# EAGLE design MicroDose (EAGLE 9.6.2)
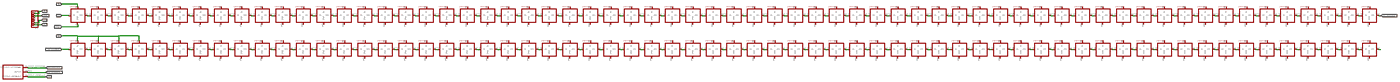
[diagram p0: schematic, sheet 1, overview]
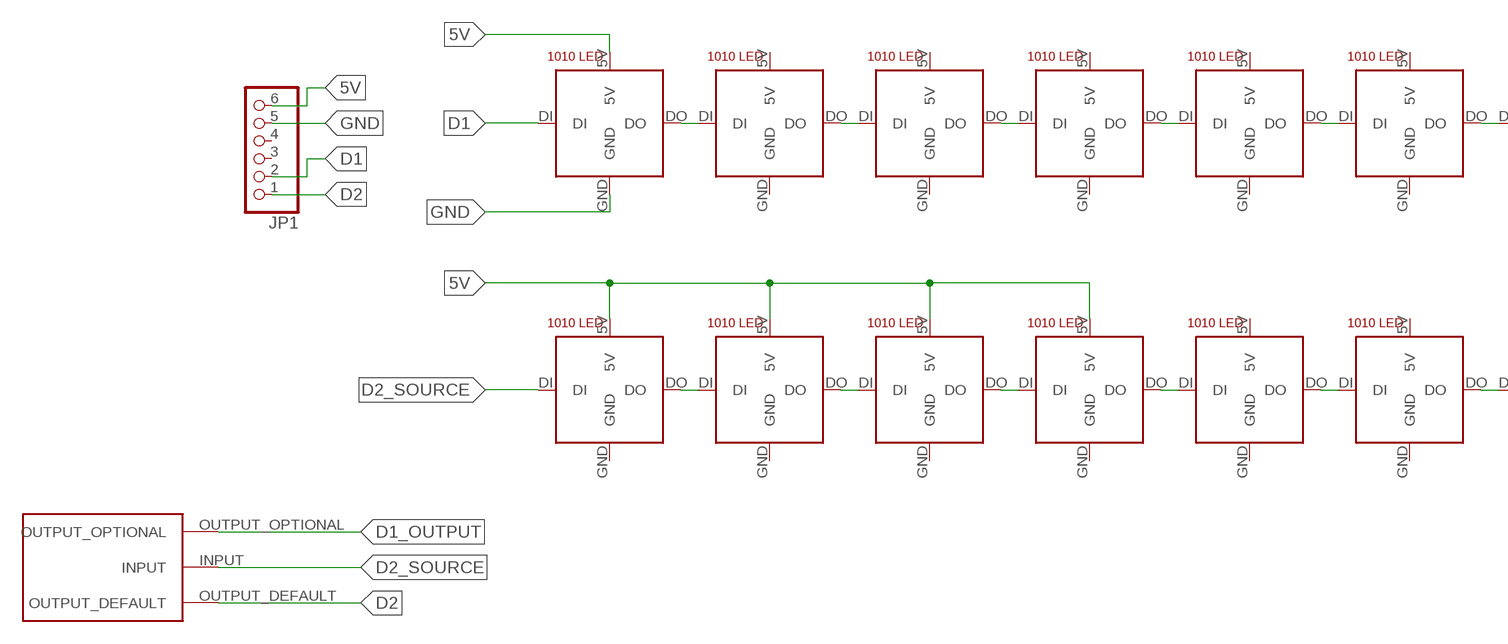
[diagram p1: schematic, sheet 1, part 1 of 5]
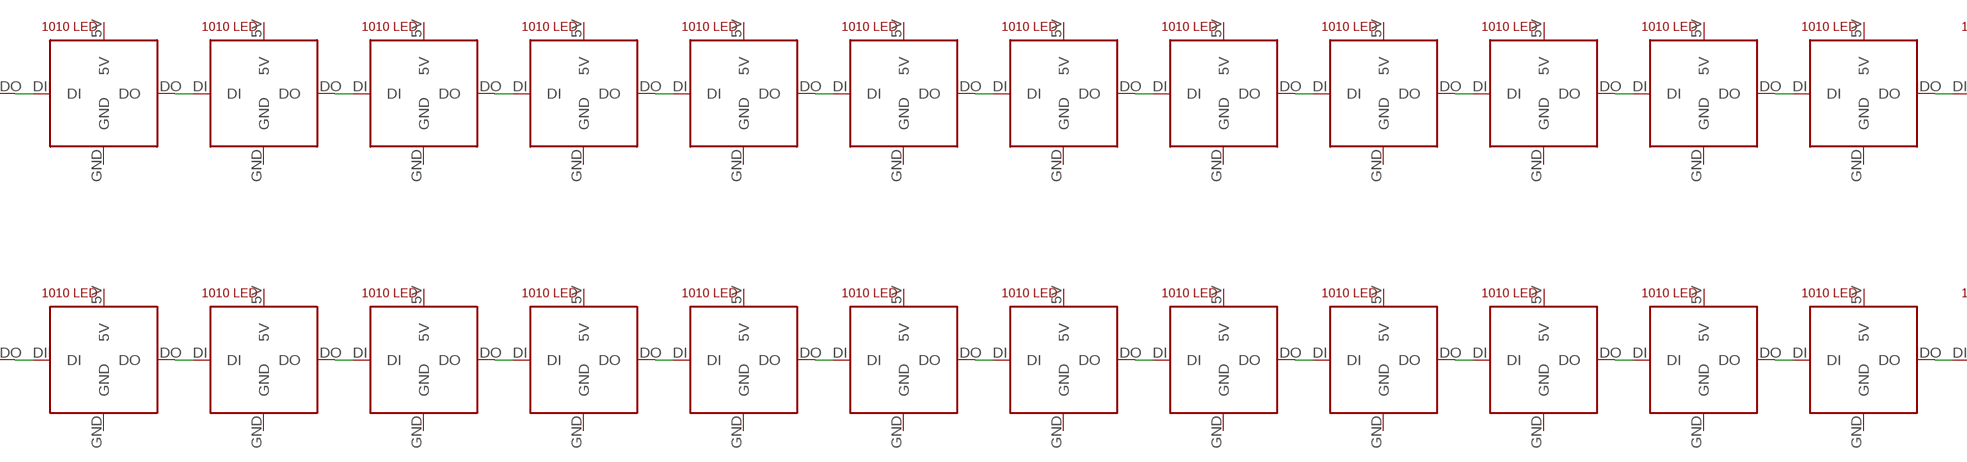
[diagram p2: schematic, sheet 1, part 2 of 5]
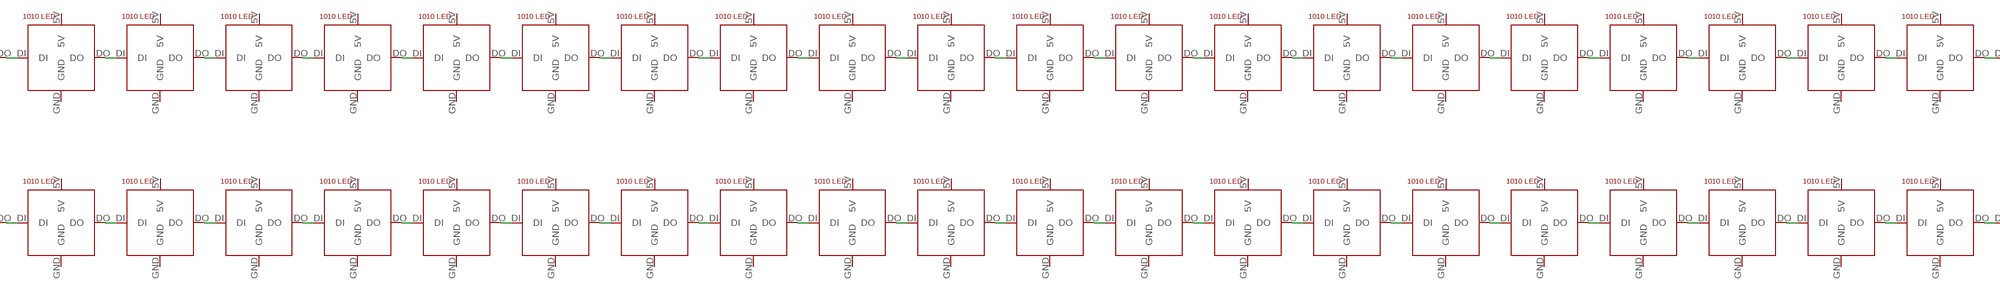
[diagram p3: schematic, sheet 1, part 3 of 5]
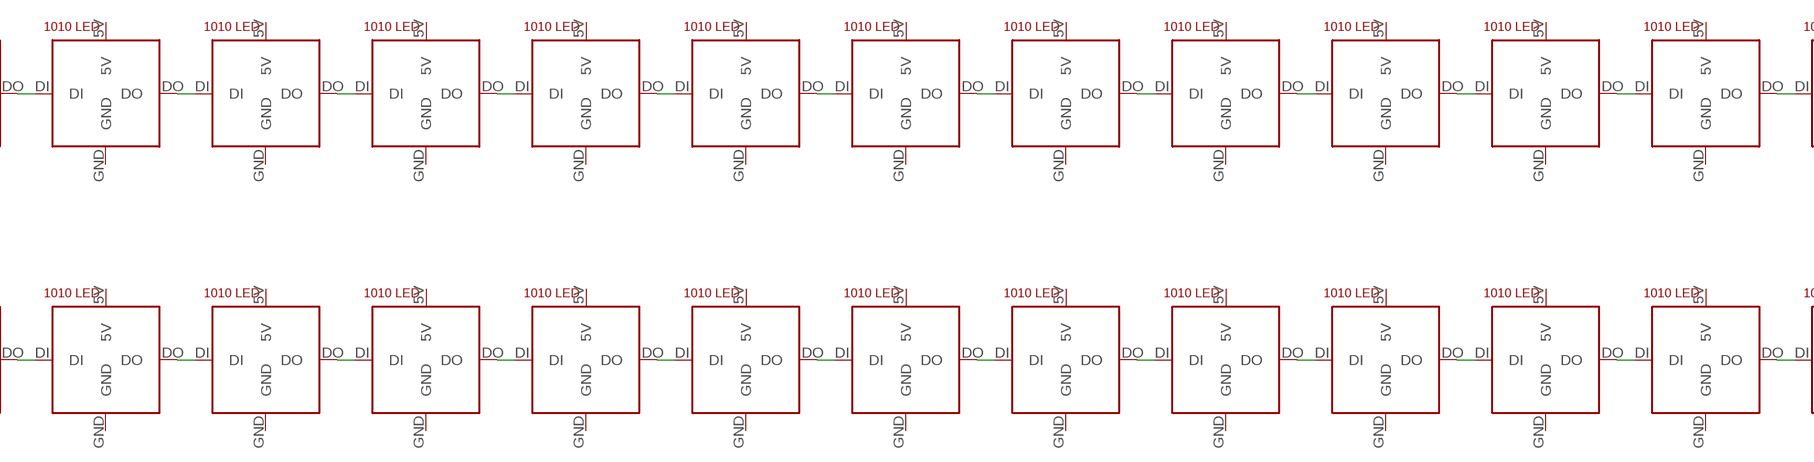
[diagram p4: schematic, sheet 1, part 4 of 5]
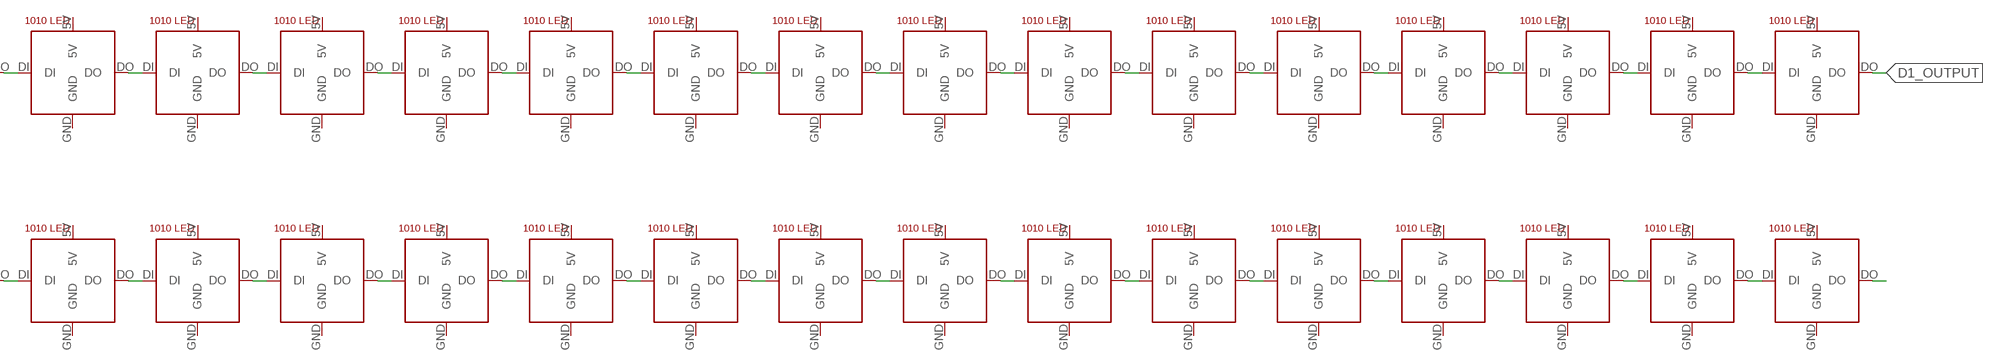
[diagram p5: schematic, sheet 1, part 5 of 5]

## Parts
JP1  PINHD-1X6/90  [1X06/90]
U$1  1010_LED  [1010_LED]
U$2  1010_LED  [1010_LED]
U$3  1010_LED  [1010_LED]
U$4  1010_LED  [1010_LED]
U$5  1010_LED  [1010_LED]
U$6  1010_LED  [1010_LED]
U$7  1010_LED  [1010_LED]
U$8  1010_LED  [1010_LED]
U$9  1010_LED  [1010_LED]
U$10  1010_LED  [1010_LED]
U$11  1010_LED  [1010_LED]
U$12  1010_LED  [1010_LED]
U$13  1010_LED  [1010_LED]
U$14  1010_LED  [1010_LED]
U$15  1010_LED  [1010_LED]
U$16  1010_LED  [1010_LED]
U$17  1010_LED  [1010_LED]
U$18  1010_LED  [1010_LED]
U$19  1010_LED  [1010_LED]
U$20  1010_LED  [1010_LED]
U$21  1010_LED  [1010_LED]
U$22  1010_LED  [1010_LED]
U$23  1010_LED  [1010_LED]
U$24  1010_LED  [1010_LED]
U$25  1010_LED  [1010_LED]
U$26  1010_LED  [1010_LED]
U$27  1010_LED  [1010_LED]
U$28  1010_LED  [1010_LED]
U$29  1010_LED  [1010_LED]
U$30  1010_LED  [1010_LED]
U$31  1010_LED  [1010_LED]
U$32  1010_LED  [1010_LED]
U$33  1010_LED  [1010_LED]
U$34  1010_LED  [1010_LED]
U$35  1010_LED  [1010_LED]
U$36  1010_LED  [1010_LED]
U$37  1010_LED  [1010_LED]
U$38  1010_LED  [1010_LED]
U$39  1010_LED  [1010_LED]
U$40  1010_LED  [1010_LED]
U$41  1010_LED  [1010_LED]
U$42  1010_LED  [1010_LED]
U$43  1010_LED  [1010_LED]
U$44  1010_LED  [1010_LED]
U$45  1010_LED  [1010_LED]
U$46  1010_LED  [1010_LED]
U$47  1010_LED  [1010_LED]
U$48  1010_LED  [1010_LED]
U$49  1010_LED  [1010_LED]
U$50  1010_LED  [1010_LED]
U$51  1010_LED  [1010_LED]
U$52  1010_LED  [1010_LED]
U$53  1010_LED  [1010_LED]
U$54  1010_LED  [1010_LED]
U$55  1010_LED  [1010_LED]
U$56  1010_LED  [1010_LED]
U$57  1010_LED  [1010_LED]
U$58  1010_LED  [1010_LED]
U$59  1010_LED  [1010_LED]
U$60  1010_LED  [1010_LED]
U$61  1010_LED  [1010_LED]
U$62  1010_LED  [1010_LED]
U$63  1010_LED  [1010_LED]
U$64  1010_LED  [1010_LED]
U$65  1010_LED  [1010_LED]
U$66  1010_LED  [1010_LED]
U$67  1010_LED  [1010_LED]
U$68  1010_LED  [1010_LED]
U$69  1010_LED  [1010_LED]
U$70  1010_LED  [1010_LED]
U$71  1010_LED  [1010_LED]
U$72  1010_LED  [1010_LED]
U$73  1010_LED  [1010_LED]
U$74  1010_LED  [1010_LED]
U$75  1010_LED  [1010_LED]
U$76  1010_LED  [1010_LED]
U$77  1010_LED  [1010_LED]
U$78  1010_LED  [1010_LED]
U$79  1010_LED  [1010_LED]
U$80  1010_LED  [1010_LED]
U$81  1010_LED  [1010_LED]
U$82  1010_LED  [1010_LED]
U$83  1010_LED  [1010_LED]
U$84  1010_LED  [1010_LED]
U$85  1010_LED  [1010_LED]
U$86  1010_LED  [1010_LED]
U$87  1010_LED  [1010_LED]
U$88  1010_LED  [1010_LED]
U$89  1010_LED  [1010_LED]
U$90  1010_LED  [1010_LED]
U$91  1010_LED  [1010_LED]
U$92  1010_LED  [1010_LED]
U$93  1010_LED  [1010_LED]
U$94  1010_LED  [1010_LED]
U$95  1010_LED  [1010_LED]
U$96  1010_LED  [1010_LED]
U$97  1010_LED  [1010_LED]
U$98  1010_LED  [1010_LED]
U$99  1010_LED  [1010_LED]
U$100  1010_LED  [1010_LED]
U$101  1010_LED  [1010_LED]
U$102  1010_LED  [1010_LED]
U$103  1010_LED  [1010_LED]
U$104  1010_LED  [1010_LED]
U$105  1010_LED  [1010_LED]
U$106  1010_LED  [1010_LED]
U$107  1010_LED  [1010_LED]
U$108  1010_LED  [1010_LED]
U$109  1010_LED  [1010_LED]
U$110  1010_LED  [1010_LED]
U$111  1010_LED  [1010_LED]
U$112  1010_LED  [1010_LED]
U$113  1010_LED  [1010_LED]
U$114  1010_LED  [1010_LED]
U$115  1010_LED  [1010_LED]
U$116  1010_LED  [1010_LED]
U$117  1010_LED  [1010_LED]
U$118  1010_LED  [1010_LED]
U$119  1010_LED  [1010_LED]
U$120  1010_LED  [1010_LED]
U$121  1010_LED  [1010_LED]
U$122  1010_LED  [1010_LED]
U$123  1010_LED  [1010_LED]
U$124  1010_LED  [1010_LED]
U$125  1010_LED  [1010_LED]
U$126  1010_LED  [1010_LED]
U$127  1010_LED  [1010_LED]
U$128  1010_LED  [1010_LED]
U$129  SOLDER_JUMPER  [SOLDER_JUMPER]

## Nets
5V: JP1.6 U$1.5V U$65.5V U$66.5V U$67.5V U$68.5V
D1: JP1.2 U$1.DI
D1_OUTPUT: U$64.DO U$129.OUTPUT_OPTIONAL
D2: JP1.1 U$129.OUTPUT_DEFAULT
D2_SOURCE: U$65.DI U$129.INPUT
GND: JP1.5 U$1.GND
N$1: U$1.DO U$2.DI
N$2: U$2.DO U$3.DI
N$3: U$3.DO U$4.DI
N$4: U$4.DO U$5.DI
N$5: U$5.DO U$6.DI
N$6: U$6.DO U$7.DI
N$7: U$7.DO U$8.DI
N$8: U$8.DO U$9.DI
N$9: U$9.DO U$10.DI
N$10: U$10.DO U$11.DI
N$11: U$11.DO U$12.DI
N$12: U$12.DO U$13.DI
N$13: U$13.DO U$14.DI
N$14: U$14.DO U$15.DI
N$15: U$15.DO U$16.DI
N$16: U$16.DO U$17.DI
N$17: U$17.DO U$18.DI
N$18: U$18.DO U$19.DI
N$19: U$19.DO U$20.DI
N$20: U$20.DO U$21.DI
N$21: U$21.DO U$22.DI
N$22: U$22.DO U$23.DI
N$23: U$23.DO U$24.DI
N$24: U$24.DO U$25.DI
N$25: U$25.DO U$26.DI
N$26: U$26.DO U$27.DI
N$27: U$27.DO U$28.DI
N$28: U$28.DO U$29.DI
N$29: U$29.DO U$30.DI
N$30: U$30.DO U$31.DI
N$31: U$31.DO U$32.DI
N$32: U$32.DO U$33.DI
N$33: U$33.DO U$34.DI
N$34: U$34.DO U$35.DI
N$35: U$35.DO U$36.DI
N$36: U$36.DO U$37.DI
N$37: U$37.DO U$38.DI
N$38: U$38.DO U$39.DI
N$39: U$39.DO U$40.DI
N$40: U$40.DO U$41.DI
N$41: U$41.DO U$42.DI
N$42: U$42.DO U$43.DI
N$43: U$43.DO U$44.DI
N$44: U$44.DO U$45.DI
N$45: U$45.DO U$46.DI
N$46: U$46.DO U$47.DI
N$47: U$47.DO U$48.DI
N$48: U$48.DO U$49.DI
N$49: U$49.DO U$50.DI
N$50: U$50.DO U$51.DI
N$51: U$51.DO U$52.DI
N$52: U$52.DO U$53.DI
N$53: U$53.DO U$54.DI
N$54: U$54.DO U$55.DI
N$55: U$55.DO U$56.DI
N$56: U$56.DO U$57.DI
N$57: U$57.DO U$58.DI
N$58: U$58.DO U$59.DI
N$59: U$59.DO U$60.DI
N$60: U$60.DO U$61.DI
N$61: U$61.DO U$62.DI
N$62: U$62.DO U$63.DI
N$63: U$63.DO U$64.DI
N$65: U$65.DO U$66.DI
N$66: U$66.DO U$67.DI
N$67: U$67.DO U$68.DI
N$68: U$68.DO U$69.DI
N$69: U$69.DO U$70.DI
N$70: U$70.DO U$71.DI
N$71: U$71.DO U$72.DI
N$72: U$72.DO U$73.DI
N$73: U$73.DO U$74.DI
N$74: U$74.DO U$75.DI
N$75: U$75.DO U$76.DI
N$76: U$76.DO U$77.DI
N$77: U$77.DO U$78.DI
N$78: U$78.DO U$79.DI
N$79: U$79.DO U$80.DI
N$80: U$80.DO U$81.DI
N$81: U$81.DO U$82.DI
N$82: U$82.DO U$83.DI
N$83: U$83.DO U$84.DI
N$84: U$84.DO U$85.DI
N$85: U$85.DO U$86.DI
N$86: U$86.DO U$87.DI
N$87: U$87.DO U$88.DI
N$88: U$88.DO U$89.DI
N$89: U$89.DO U$90.DI
N$90: U$90.DO U$91.DI
N$91: U$91.DO U$92.DI
N$92: U$92.DO U$93.DI
N$93: U$93.DO U$94.DI
N$94: U$94.DO U$95.DI
N$95: U$95.DO U$96.DI
N$96: U$96.DO U$97.DI
N$97: U$97.DO U$98.DI
N$98: U$98.DO U$99.DI
N$99: U$99.DO U$100.DI
N$100: U$100.DO U$101.DI
N$101: U$101.DO U$102.DI
N$102: U$102.DO U$103.DI
N$103: U$103.DO U$104.DI
N$104: U$104.DO U$105.DI
N$105: U$105.DO U$106.DI
N$106: U$106.DO U$107.DI
N$107: U$107.DO U$108.DI
N$108: U$108.DO U$109.DI
N$109: U$109.DO U$110.DI
N$110: U$110.DO U$111.DI
N$111: U$111.DO U$112.DI
N$112: U$112.DO U$113.DI
N$113: U$113.DO U$114.DI
N$114: U$114.DO U$115.DI
N$115: U$115.DO U$116.DI
N$116: U$116.DO U$117.DI
N$117: U$117.DO U$118.DI
N$118: U$118.DO U$119.DI
N$119: U$119.DO U$120.DI
N$120: U$120.DO U$121.DI
N$121: U$121.DO U$122.DI
N$122: U$122.DO U$123.DI
N$123: U$123.DO U$124.DI
N$124: U$124.DO U$125.DI
N$125: U$125.DO U$126.DI
N$126: U$126.DO U$127.DI
N$127: U$127.DO U$128.DI
N$128: U$128.DO
Unconnected: JP1.3 JP1.4

## Power pins joined to a net without a drawn wire
5V: U$2.5V U$3.5V U$4.5V U$5.5V U$6.5V U$7.5V U$8.5V U$9.5V U$10.5V U$11.5V U$12.5V U$13.5V U$14.5V U$15.5V U$16.5V U$17.5V U$18.5V U$19.5V U$20.5V U$21.5V U$22.5V U$23.5V U$24.5V U$25.5V U$26.5V U$27.5V U$28.5V U$29.5V U$30.5V U$31.5V U$32.5V U$33.5V U$34.5V U$35.5V U$36.5V U$37.5V U$38.5V U$39.5V U$40.5V U$41.5V U$42.5V U$43.5V U$44.5V U$45.5V U$46.5V U$47.5V U$48.5V U$49.5V U$50.5V U$51.5V U$52.5V U$53.5V U$54.5V U$55.5V U$56.5V U$57.5V U$58.5V U$59.5V U$60.5V U$61.5V U$62.5V U$63.5V U$64.5V U$69.5V U$70.5V U$71.5V U$72.5V U$73.5V U$74.5V U$75.5V U$76.5V U$77.5V U$78.5V U$79.5V U$80.5V U$81.5V U$82.5V U$83.5V U$84.5V U$85.5V U$86.5V U$87.5V U$88.5V U$89.5V U$90.5V U$91.5V U$92.5V U$93.5V U$94.5V U$95.5V U$96.5V U$97.5V U$98.5V U$99.5V U$100.5V U$101.5V U$102.5V U$103.5V U$104.5V U$105.5V U$106.5V U$107.5V U$108.5V U$109.5V U$110.5V U$111.5V U$112.5V U$113.5V U$114.5V U$115.5V U$116.5V U$117.5V U$118.5V U$119.5V U$120.5V U$121.5V U$122.5V U$123.5V U$124.5V U$125.5V U$126.5V U$127.5V U$128.5V
GND: U$2.GND U$3.GND U$4.GND U$5.GND U$6.GND U$7.GND U$8.GND U$9.GND U$10.GND U$11.GND U$12.GND U$13.GND U$14.GND U$15.GND U$16.GND U$17.GND U$18.GND U$19.GND U$20.GND U$21.GND U$22.GND U$23.GND U$24.GND U$25.GND U$26.GND U$27.GND U$28.GND U$29.GND U$30.GND U$31.GND U$32.GND U$33.GND U$34.GND U$35.GND U$36.GND U$37.GND U$38.GND U$39.GND U$40.GND U$41.GND U$42.GND U$43.GND U$44.GND U$45.GND U$46.GND U$47.GND U$48.GND U$49.GND U$50.GND U$51.GND U$52.GND U$53.GND U$54.GND U$55.GND U$56.GND U$57.GND U$58.GND U$59.GND U$60.GND U$61.GND U$62.GND U$63.GND U$64.GND U$65.GND U$66.GND U$67.GND U$68.GND U$69.GND U$70.GND U$71.GND U$72.GND U$73.GND U$74.GND U$75.GND U$76.GND U$77.GND U$78.GND U$79.GND U$80.GND U$81.GND U$82.GND U$83.GND U$84.GND U$85.GND U$86.GND U$87.GND U$88.GND U$89.GND U$90.GND U$91.GND U$92.GND U$93.GND U$94.GND U$95.GND U$96.GND U$97.GND U$98.GND U$99.GND U$100.GND U$101.GND U$102.GND U$103.GND U$104.GND U$105.GND U$106.GND U$107.GND U$108.GND U$109.GND U$110.GND U$111.GND U$112.GND U$113.GND U$114.GND U$115.GND U$116.GND U$117.GND U$118.GND U$119.GND U$120.GND U$121.GND U$122.GND U$123.GND U$124.GND U$125.GND U$126.GND U$127.GND U$128.GND

## Library data of the parts
JP1 = pinhead:PINHD-1X6: PIN HEADER
U$1-U$128 = 1010_LED:1010_LED
U$129 = SOLDER_JUMPER:SOLDER_JUMPER

## Board
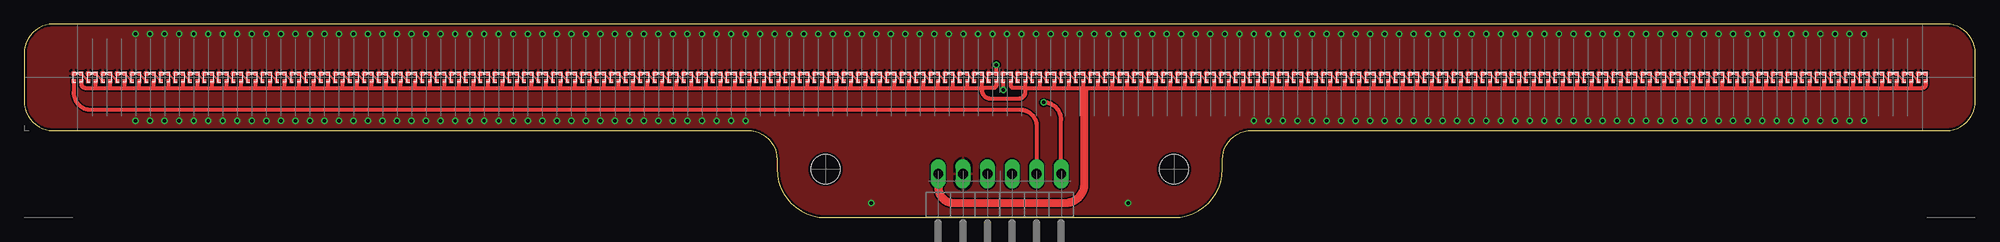
[diagram p6: board, top side]
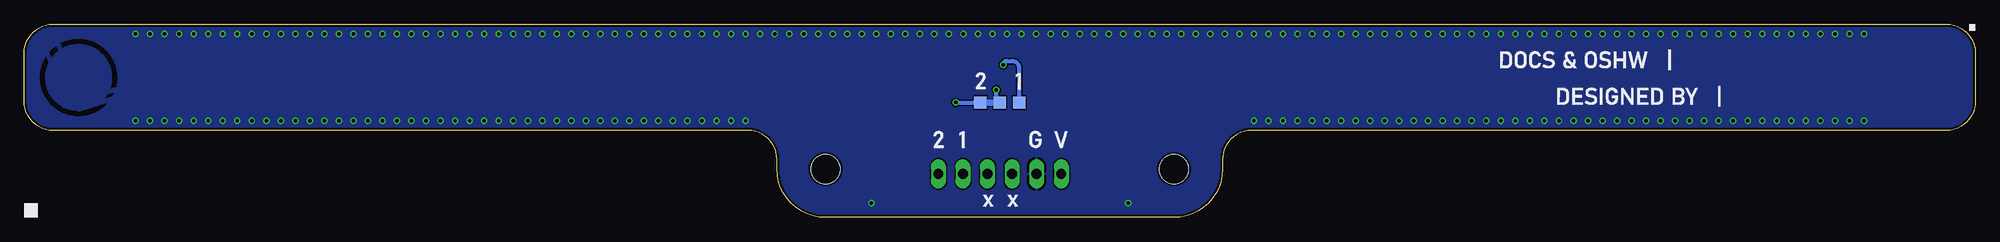
[diagram p7: board, bottom side, seen from below]

Size 201.5 x 20 mm. Coordinates in mm from the lower left corner, seen from the top.
Outline: 123.71,4.35 123.75,5 123.75,6 123.78,6.39 123.85,6.78 123.98,7.15 124.15,7.5 124.37,7.83 124.63,8.12 124.92,8.38 125.25,8.6 125.6,8.77 125.97,8.9 126.36,8.97 126.75,9 198.5,9 198.89,9.03 199.28,9.1 199.65,9.23 200,9.4 200.33,9.62 200.62,9.88 200.88,10.17 201.1,10.5 201.27,10.85 201.4,11.22 201.47,11.61 201.5,12 201.5,17 201.47,17.39 201.4,17.78 201.27,18.15 201.1,18.5 200.88,18.83 200.62,19.12 200.33,19.38 200,19.6 199.65,19.77 199.28,19.9 198.89,19.97 198.5,20 3,20 2.61,19.97 2.22,19.9 1.85,19.77 1.5,19.6 1.17,19.38 0.88,19.12 0.62,18.83 0.4,18.5 0.23,18.15 0.1,17.78 0.03,17.39 0,17 0,12 0.03,11.61 0.1,11.22 0.23,10.85 0.4,10.5 0.62,10.17 0.88,9.88 1.17,9.62 1.5,9.4 1.85,9.23 2.22,9.1 2.61,9.03 3,9 74.75,9 75.14,8.97 75.53,8.9 75.9,8.77 76.25,8.6 76.58,8.38 76.87,8.12 77.13,7.83 77.35,7.5 77.52,7.15 77.65,6.78 77.72,6.39 77.75,6 77.75,5 77.79,4.35 77.8,4.29 77.92,3.71 78.13,3.09 78.42,2.5 78.78,1.96 79.21,1.46 79.71,1.03 80.25,0.67 80.84,0.38 81.46,0.17 82.1,0.04 82.75,0 118.75,0 119.4,0.04 120.04,0.17 120.66,0.38 121.25,0.67 121.79,1.03 122.29,1.46 122.72,1.96 123.08,2.5 123.37,3.09 123.58,3.71 123.7,4.29 123.71,4.35
Copper layers (1*16): Top 0.035mm / dielectric 1.5mm / Bottom 0.035mm
Design rules "dirt_cheap_dirty_boards.v1.1": minimum track width 6mil, minimum drill 12mil, track to track 6mil, track to pad 6mil, pad to pad 6mil, via to via 6mil, smd to smd 0mil, copper to edge 10mil, drill to drill 10mil, minimum pad ring 10mil, minimum via ring 6mil, stop-mask expansion 2mil, vias tented up to drill 25mil, thermal gap 10mil
Holes 3 mm at 82.75,5 118.75,5
bRestrict: area 0,19.3 to 0.6,20; area 191.9,13.3 to 197.7,18.5; area 198,16.6 to 198.9,17.7; area 192.9,10.5 to 199.9,16.7; area 192.2,12.3 to 193.2,12.9; area 200.1,0 to 201.5,1.5

### Footprints (pad centres in the part's own frame; a part is rotated, then mirrored left to right if it is on the bottom)
1X06/90 = drill 1.016 long: 1 -6.35,-3.81; 2 -3.81,-3.81; 3 -1.27,-3.81; 4 1.27,-3.81; 5 3.81,-3.81; 6 6.35,-3.81
1010_LED = smd 0.4 x 0.4: 5V 0.4,0.4; DI 0.4,-0.4; DO -0.4,0.4; GND -0.4,-0.4
SOLDER_JUMPER = smd 1.27 x 1.27: INPUT 0,0; OUTPUT_DEFAULT 2,0; OUTPUT_OPTIONAL -2,0

### Placement (x,y rotation side)
JP1  100.75,0.7 180 top
U$1  5.5,14.5 270 top
U$2  7,14.5 270 top
U$3  8.5,14.5 270 top
U$4  10,14.5 270 top
U$5  11.5,14.5 270 top
U$6  13,14.5 270 top
U$7  14.5,14.5 270 top
U$8  16,14.5 270 top
U$9  17.5,14.5 270 top
U$10  19,14.5 270 top
U$11  20.5,14.5 270 top
U$12  22,14.5 270 top
U$13  23.5,14.5 270 top
U$14  25,14.5 270 top
U$15  26.5,14.5 270 top
U$16  28,14.5 270 top
U$17  29.5,14.5 270 top
U$18  31,14.5 270 top
U$19  32.5,14.5 270 top
U$20  34,14.5 270 top
U$21  35.5,14.5 270 top
U$22  37,14.5 270 top
U$23  38.5,14.5 270 top
U$24  40,14.5 270 top
U$25  41.5,14.5 270 top
U$26  43,14.5 270 top
U$27  44.5,14.5 270 top
U$28  46,14.5 270 top
U$29  47.5,14.5 270 top
U$30  49,14.5 270 top
U$31  50.5,14.5 270 top
U$32  52,14.5 270 top
U$33  53.5,14.5 270 top
U$34  55,14.5 270 top
U$35  56.5,14.5 270 top
U$36  58,14.5 270 top
U$37  59.5,14.5 270 top
U$38  61,14.5 270 top
U$39  62.5,14.5 270 top
U$40  64,14.5 270 top
U$41  65.5,14.5 270 top
U$42  67,14.5 270 top
U$43  68.5,14.5 270 top
U$44  70,14.5 270 top
U$45  71.5,14.5 270 top
U$46  73,14.5 270 top
U$47  74.5,14.5 270 top
U$48  76,14.5 270 top
U$49  77.5,14.5 270 top
U$50  79,14.5 270 top
U$51  80.5,14.5 270 top
U$52  82,14.5 270 top
U$53  83.5,14.5 270 top
U$54  85,14.5 270 top
U$55  86.5,14.5 270 top
U$56  88,14.5 270 top
U$57  89.5,14.5 270 top
U$58  91,14.5 270 top
U$59  92.5,14.5 270 top
U$60  94,14.5 270 top
U$61  95.5,14.5 270 top
U$62  97,14.5 270 top
U$63  98.5,14.5 270 top
U$64  100,14.5 270 top
U$65  101.5,14.5 270 top
U$66  103,14.5 270 top
U$67  104.5,14.5 270 top
U$68  106,14.5 270 top
U$69  107.5,14.5 270 top
U$70  109,14.5 270 top
U$71  110.5,14.5 270 top
U$72  112,14.5 270 top
U$73  113.5,14.5 270 top
U$74  115,14.5 270 top
U$75  116.5,14.5 270 top
U$76  118,14.5 270 top
U$77  119.5,14.5 270 top
U$78  121,14.5 270 top
U$79  122.5,14.5 270 top
U$80  124,14.5 270 top
U$81  125.5,14.5 270 top
U$82  127,14.5 270 top
U$83  128.5,14.5 270 top
U$84  130,14.5 270 top
U$85  131.5,14.5 270 top
U$86  133,14.5 270 top
U$87  134.5,14.5 270 top
U$88  136,14.5 270 top
U$89  137.5,14.5 270 top
U$90  139,14.5 270 top
U$91  140.5,14.5 270 top
U$92  142,14.5 270 top
U$93  143.5,14.5 270 top
U$94  145,14.5 270 top
U$95  146.5,14.5 270 top
U$96  148,14.5 270 top
U$97  149.5,14.5 270 top
U$98  151,14.5 270 top
U$99  152.5,14.5 270 top
U$100  154,14.5 270 top
U$101  155.5,14.5 270 top
U$102  157,14.5 270 top
U$103  158.5,14.5 270 top
U$104  160,14.5 270 top
U$105  161.5,14.5 270 top
U$106  163,14.5 270 top
U$107  164.5,14.5 270 top
U$108  166,14.5 270 top
U$109  167.5,14.5 270 top
U$110  169,14.5 270 top
U$111  170.5,14.5 270 top
U$112  172,14.5 270 top
U$113  173.5,14.5 270 top
U$114  175,14.5 270 top
U$115  176.5,14.5 270 top
U$116  178,14.5 270 top
U$117  179.5,14.5 270 top
U$118  181,14.5 270 top
U$119  182.5,14.5 270 top
U$120  184,14.5 270 top
U$121  185.5,14.5 270 top
U$122  187,14.5 270 top
U$123  188.5,14.5 270 top
U$124  190,14.5 270 top
U$125  191.5,14.5 270 top
U$126  193,14.5 270 top
U$127  194.5,14.5 270 top
U$128  196,14.5 270 top
U$129  100.75,11.9 180 bottom

### Tracks (layer width: path | path; a pad name or v marks a point on that pad's centre or on a via)
5V
  Top 0.406: U$1.5V 5.9,13.8 arc90 6.3,13.4 7.4,13.4 | 7.4,13.4 U$2.5V | 7.4,13.4 8.9,13.4 | 8.9,13.4 U$3.5V | 8.9,13.4 10.4,13.4 | 10.4,13.4 U$4.5V | 10.4,13.4 11.9,13.4 | 11.9,13.4 U$5.5V | 11.9,13.4 13.4,13.4 | 13.4,13.4 U$6.5V | 13.4,13.4 14.9,13.4 | 14.9,13.4 U$7.5V | 14.9,13.4 16.4,13.4 | 16.4,13.4 U$8.5V | 16.4,13.4 17.9,13.4 | 17.9,13.4 U$9.5V | 17.9,13.4 19.4,13.4 | 19.4,13.4 U$10.5V | 19.4,13.4 20.9,13.4 | 20.9,13.4 U$11.5V | 20.9,13.4 22.4,13.4 | 22.4,13.4 U$12.5V | 22.4,13.4 23.9,13.4 | 23.9,13.4 U$13.5V | 23.9,13.4 25.4,13.4 | 25.4,13.4 U$14.5V | 25.4,13.4 26.9,13.4 | 26.9,13.4 U$15.5V | 26.9,13.4 28.4,13.4 | 28.4,13.4 U$16.5V | 28.4,13.4 29.9,13.4 | 29.9,13.4 U$17.5V | 29.9,13.4 31.4,13.4 | 31.4,13.4 U$18.5V | 31.4,13.4 32.9,13.4 | 32.9,13.4 U$19.5V | 32.9,13.4 34.4,13.4 | 34.4,13.4 U$20.5V | 34.4,13.4 35.9,13.4 | 35.9,13.4 U$21.5V | 35.9,13.4 37.4,13.4 | 37.4,13.4 U$22.5V | 37.4,13.4 38.9,13.4 | 38.9,13.4 U$23.5V | 38.9,13.4 40.4,13.4 | 40.4,13.4 U$24.5V | 40.4,13.4 41.9,13.4 | 41.9,13.4 U$25.5V | 41.9,13.4 43.4,13.4 | 43.4,13.4 U$26.5V | 43.4,13.4 44.9,13.4 | 44.9,13.4 U$27.5V | 44.9,13.4 46.4,13.4 | 46.4,13.4 U$28.5V | 46.4,13.4 47.9,13.4 | 47.9,13.4 U$29.5V | 47.9,13.4 49.4,13.4 | 49.4,13.4 U$30.5V | 49.4,13.4 50.9,13.4 | 50.9,13.4 U$31.5V | 50.9,13.4 52.4,13.4 | 52.4,13.4 U$32.5V | 52.4,13.4 53.9,13.4 | 53.9,13.4 U$33.5V | 53.9,13.4 55.4,13.4 | 55.4,13.4 U$34.5V | 55.4,13.4 56.9,13.4 | 56.9,13.4 U$35.5V | 56.9,13.4 58.4,13.4 | 58.4,13.4 U$36.5V | 58.4,13.4 59.9,13.4 | 59.9,13.4 U$37.5V | 59.9,13.4 61.4,13.4 | 61.4,13.4 U$38.5V | 61.4,13.4 62.9,13.4 | 62.9,13.4 U$39.5V | 62.9,13.4 64.4,13.4 | 64.4,13.4 U$40.5V | 64.4,13.4 65.9,13.4 | 65.9,13.4 U$41.5V | 65.9,13.4 67.4,13.4 | 67.4,13.4 U$42.5V | 67.4,13.4 68.9,13.4
  Top 0.406: 68.9,13.4 U$43.5V | 68.9,13.4 70.4,13.4 | 70.4,13.4 U$44.5V | 70.4,13.4 71.9,13.4 | 71.9,13.4 U$45.5V | 71.9,13.4 73.4,13.4 | 73.4,13.4 U$46.5V | 73.4,13.4 74.9,13.4 | 74.9,13.4 U$47.5V | 74.9,13.4 76.4,13.4 | 76.4,13.4 U$48.5V | 76.4,13.4 77.9,13.4 | 77.9,13.4 U$49.5V | 77.9,13.4 79.4,13.4 | 79.4,13.4 U$50.5V | 79.4,13.4 80.9,13.4 | 80.9,13.4 U$51.5V | 80.9,13.4 82.4,13.4 | 82.4,13.4 U$52.5V | 82.4,13.4 83.9,13.4 | 83.9,13.4 U$53.5V | 83.9,13.4 85.4,13.4 | 85.4,13.4 U$54.5V | 85.4,13.4 86.9,13.4 | 86.9,13.4 U$55.5V | 86.9,13.4 88.4,13.4 | 88.4,13.4 U$56.5V | 88.4,13.4 89.9,13.4 | 89.9,13.4 U$57.5V | 89.9,13.4 91.4,13.4 | 91.4,13.4 U$58.5V | 91.4,13.4 92.9,13.4 | 92.9,13.4 U$59.5V | 92.9,13.4 94.4,13.4 | 94.4,13.4 U$60.5V | 94.4,13.4 95.9,13.4 | 95.9,13.4 U$61.5V | 95.9,13.4 97.4,13.4 | 97.4,13.4 U$62.5V | 97.4,13.4 98.9,13.4 | 98.9,13.4 U$63.5V | U$64.5V 100.4,13.7 arc-90 100.1,13.4 98.9,13.4 | 103.4,13.4 102.2,13.4 arc-90 101.9,13.7 U$65.5V | 103.4,13.4 U$66.5V 103.4,13 arc-90 102.7,12.3 99.8,12.3 arc-90 98.9,13.2 98.9,13.4 | 103.4,13.4 104.9,13.4 | 104.9,13.4 U$67.5V | 104.9,13.4 106.4,13.4 | 106.4,13.4 U$68.5V | 106.4,13.4 107.9,13.4 | 107.9,13.4 U$69.5V | 107.9,13.4 109.4,13.4 | 109.4,13.4 U$70.5V | 109.5,13.4 110.9,13.4 | 110.9,13.4 U$71.5V | 110.9,13.4 112.4,13.4 | 112.4,13.4 U$72.5V | 112.4,13.4 113.9,13.4 | U$73.5V 113.9,13.4 | 113.9,13.4 115.4,13.4 | 115.4,13.4 U$74.5V | 115.4,13.4 116.9,13.4 | 116.9,13.4 U$75.5V | 116.9,13.4 118.4,13.4 | 118.4,13.4 U$76.5V | 118.4,13.4 119.9,13.4 | 119.9,13.4 U$77.5V | 119.9,13.4 121.4,13.4 | 121.4,13.4 U$78.5V | 121.4,13.4 122.9,13.4 | 122.9,13.4 U$79.5V | 122.9,13.4 124.4,13.4 | 124.4,13.4 U$80.5V | 124.4,13.4 125.9,13.4 | 125.9,13.4 U$81.5V | 125.9,13.4 127.4,13.4
  Top 0.406: 127.4,13.4 U$82.5V | 127.4,13.4 128.9,13.4 | 128.9,13.4 U$83.5V | 128.9,13.4 130.4,13.4 | 130.4,13.4 U$84.5V | 130.4,13.4 131.9,13.4 | 131.9,13.4 U$85.5V | 131.9,13.4 133.4,13.4 | 133.4,13.4 U$86.5V | 133.4,13.4 134.9,13.4 | 134.9,13.4 U$87.5V | 134.9,13.4 136.4,13.4 | 136.4,13.4 U$88.5V | 136.4,13.4 137.9,13.4 | 137.9,13.4 U$89.5V | 137.9,13.4 139.4,13.4 | 139.4,13.4 U$90.5V | 139.4,13.4 140.9,13.4 | 140.9,13.4 U$91.5V | 140.9,13.4 142.4,13.4 | 142.4,13.4 U$92.5V | 142.4,13.4 143.9,13.4 | 143.9,13.4 U$93.5V | 143.9,13.4 145.4,13.4 | 145.4,13.4 U$94.5V | 145.4,13.4 146.9,13.4 | 146.9,13.4 U$95.5V | 146.9,13.4 148.4,13.4 | 148.4,13.4 U$96.5V | 148.4,13.4 149.9,13.4 | 149.9,13.4 U$97.5V | 149.9,13.4 151.4,13.4 | 151.4,13.4 U$98.5V | 151.4,13.4 152.9,13.4 | 152.9,13.4 U$99.5V | 152.9,13.4 154.4,13.4 | 154.4,13.4 U$100.5V | 154.4,13.4 155.9,13.4 | 155.9,13.4 U$101.5V | 155.9,13.4 157.4,13.4 | 157.4,13.4 U$102.5V | 157.4,13.4 158.9,13.4 | 158.9,13.4 U$103.5V | 158.9,13.4 160.4,13.4 | 160.4,13.4 U$104.5V | 160.4,13.4 161.9,13.4 | 161.9,13.4 U$105.5V | 161.9,13.4 163.4,13.4 | 163.4,13.4 U$106.5V | 163.4,13.4 164.9,13.4 | 164.9,13.4 U$107.5V | 164.9,13.4 166.4,13.4 | 166.4,13.4 U$108.5V | 166.4,13.4 167.9,13.4 | 167.9,13.4 U$109.5V | 167.9,13.4 169.4,13.4 | 169.4,13.4 U$110.5V | 169.4,13.4 170.9,13.4 | 170.9,13.4 U$111.5V | 170.9,13.4 172.4,13.4 | 172.4,13.4 U$112.5V | 172.4,13.4 173.9,13.4 | 173.9,13.4 U$113.5V | 173.9,13.4 175.4,13.4 | 175.4,13.4 U$114.5V | 175.4,13.4 176.9,13.4 | 176.9,13.4 U$115.5V | 176.9,13.4 178.4,13.4 | 178.4,13.4 U$116.5V | 178.4,13.4 179.9,13.4 | 179.9,13.4 U$117.5V | 179.9,13.4 181.4,13.4 | 181.4,13.4 U$118.5V | 181.4,13.4 182.9,13.4 | 182.9,13.4 U$119.5V | 182.9,13.4 184.4,13.4
  Top 0.406: 184.4,13.4 U$120.5V | 184.4,13.4 185.9,13.4 | 185.9,13.4 U$121.5V | 185.9,13.4 187.4,13.4 | 187.4,13.4 U$122.5V | 187.4,13.4 188.9,13.4 | 188.9,13.4 U$123.5V | 188.9,13.4 190.4,13.4 | 190.4,13.4 U$124.5V | 190.4,13.4 191.9,13.4 | 191.9,13.4 U$125.5V | 191.9,13.4 193.4,13.4 | 193.4,13.4 U$126.5V | 193.4,13.4 194.9,13.4 | 194.9,13.4 U$127.5V | 194.9,13.4 196,13.4 arc90 196.4,13.8 U$128.5V | 109.5,13.15 109.5,13.4 | 109.5,13.4 109.4,13.4
  Top 0.813: JP1.6 94.4,3.1 arc90 96,1.5 107.5,1.5 arc90 109.5,3.5 109.5,13.15
D1
  Top 0.406: U$1.DI 5.1,12.94 arc90 6.89,11.15 102.84,11.15 arc-90 104.56,9.43 JP1.2
D1_OUTPUT  (via drill 0.35)
  Top 0.406: U$64.DO v100.4,15.8
  Bottom 0.406: U$129.OUTPUT_OPTIONAL 98.75,15.45 arc-90 99.5,16.2 100,16.2 arc-90 v100.4,15.8
D2  (via drill 0.35)
  Top 0.406: JP1.1 107.1,10.1 arc90 v105.3,11.9
  Bottom 0.406: v105.3,11.9 U$129.OUTPUT_DEFAULT
D2_SOURCE  (via drill 0.35)
  Top 0.406: U$65.DI v101.1,13.2
  Bottom 0.406: U$129.INPUT 101.1,12.39 v101.1,13.2
GND  (via drill 0.35)
  other vias: 87.5,1.5 114,1.5 11.5,10 13,10 14.5,10 16,10 17.5,10 19,10 20.5,10 22,10 23.5,10 25,10 26.5,10 28,10 29.5,10 31,10 32.5,10 34,10 35.5,10 37,10 38.5,10 40,10 41.5,10 43,10 44.5,10 46,10 47.5,10 49,10 50.5,10 52,10 53.5,10 55,10 56.5,10 58,10 59.5,10 61,10 62.5,10 64,10 65.5,10 67,10 68.5,10 70,10 71.5,10 73,10 74.5,10 11.5,19 13,19 14.5,19 16,19 17.5,19 19,19 20.5,19 22,19 23.5,19 25,19 26.5,19 28,19 29.5,19 31,19 32.5,19 34,19 35.5,19 37,19 38.5,19 40,19 41.5,19 43,19 44.5,19 46,19 47.5,19 49,19 50.5,19 52,19 53.5,19 55,19 56.5,19 58,19 59.5,19 61,19 62.5,19 64,19 65.5,19 67,19 68.5,19 70,19 71.5,19 73,19 74.5,19 127,10 128.5,10 130,10 131.5,10 133,10 134.5,10 136,10 137.5,10 139,10 140.5,10 142,10 143.5,10 145,10 146.5,10 148,10 149.5,10 151,10 152.5,10 154,10 155.5,10 157,10 158.5,10 160,10 161.5,10 163,10 164.5,10 166,10 167.5,10 169,10 170.5,10 172,10 173.5,10 175,10 176.5,10 178,10 179.5,10 181,10 182.5,10 184,10 185.5,10 187,10 188.5,10 190,10 190,19 188.5,19 187,19 185.5,19 184,19 182.5,19 181,19 179.5,19 178,19 176.5,19 175,19 173.5,19 172,19 170.5,19 169,19 167.5,19 166,19 164.5,19 163,19 161.5,19 160,19 158.5,19 157,19 155.5,19 154,19 152.5,19 151,19 149.5,19 148,19 146.5,19 145,19 143.5,19 142,19 140.5,19 139,19 137.5,19 136,19 134.5,19 133,19 131.5,19 130,19 128.5,19 127,19 125.5,19 124,19 122.5,19 121,19 119.5,19 118,19 116.5,19 115,19 113.5,19 112,19 110.5,19 109,19 107.5,19 106,19 104.5,19 103,19 101.5,19 100,19 98.5,19 97,19 95.5,19 94,19 92.5,19 91,19 89.5,19 88,19 86.5,19 85,19 83.5,19 82,19 80.5,19 79,19 77.5,19 76,19
  pour Top: -0.1,17.5 0.3,18.7 0.8,19.2 2,20 3.4,20.2 198.9,20.2 199.79,19.88 200.9,19.1 201.55,17.93 201.7,17.1 201.7,11.6 201.5,11 200.83,9.83 199.38,8.93 199.2,8.9 126.5,8.9 125.5,8.7 124.8,8.1 124.24,7.46 123.82,6.28 123.9,5.8 123.7,3.46 123.26,2.53 122.06,1.07 120.15,0.05 117.4,-0.11 81.92,-0.11 81.1,0.1 79.02,1.44 78.04,2.8 77.56,4.31 77.5,5.1 77.5,6.78 76.7,8.06 75.47,8.78 75.3,8.8 3.13,8.8 1.89,9.09 0.7,9.8 0.04,10.85 -0.1,11.7
  pour Bottom: 0,18 0.5,19 1,19.5 2,20 3,20 199,20 199.5,20 200.5,19.5 201,19 201.5,18 201.5,17.5 201.5,11.5 201.5,11 201,10 200.5,9.5 199.5,9 199,9 126.5,9 125.5,8.5 125,8 124.5,7.5 124,7 124,6.5 124,6 124,5 124,4.5 123.5,3 123,2 122.5,1.5 122,1 121,0.5 120,0 119,0 83,0 82,0 80.5,0.5 79.5,1 79,1.5 78.5,2 78,3 77.5,4.5 77.5,5.5 77.5,7 77,7.5 76.5,8 76,8.5 75,9 74.5,9 3,9 2.5,9 2,9 1,9.5 0.5,10 0,11
N$1
  Top 0.152: U$1.DO U$2.DI
N$2
  Top 0.152: U$2.DO U$3.DI
N$3
  Top 0.152: U$3.DO U$4.DI
N$4
  Top 0.152: U$4.DO U$5.DI
N$5
  Top 0.152: U$5.DO U$6.DI
N$6
  Top 0.152: U$6.DO U$7.DI
N$7
  Top 0.152: U$7.DO U$8.DI
N$8
  Top 0.152: U$8.DO U$9.DI
N$9
  Top 0.152: U$9.DO U$10.DI
N$10
  Top 0.152: U$10.DO U$11.DI
N$11
  Top 0.152: U$11.DO U$12.DI
N$12
  Top 0.152: U$12.DO U$13.DI
N$13
  Top 0.152: U$13.DO U$14.DI
N$14
  Top 0.152: U$14.DO U$15.DI
N$15
  Top 0.152: U$15.DO U$16.DI
N$16
  Top 0.152: U$16.DO U$17.DI
N$17
  Top 0.152: U$17.DO U$18.DI
N$18
  Top 0.152: U$18.DO U$19.DI
N$19
  Top 0.152: U$19.DO U$20.DI
N$20
  Top 0.152: U$20.DO U$21.DI
N$21
  Top 0.152: U$21.DO U$22.DI
N$22
  Top 0.152: U$22.DO U$23.DI
N$23
  Top 0.152: U$23.DO U$24.DI
N$24
  Top 0.152: U$24.DO U$25.DI
N$25
  Top 0.152: U$25.DO U$26.DI
N$26
  Top 0.152: U$26.DO U$27.DI
N$27
  Top 0.152: U$27.DO U$28.DI
N$28
  Top 0.152: U$28.DO U$29.DI
N$29
  Top 0.152: U$29.DO U$30.DI
N$30
  Top 0.152: U$30.DO U$31.DI
N$31
  Top 0.152: U$31.DO U$32.DI
N$32
  Top 0.152: U$32.DO U$33.DI
N$33
  Top 0.152: U$33.DO U$34.DI
N$34
  Top 0.152: U$34.DO U$35.DI
N$35
  Top 0.152: U$35.DO U$36.DI
N$36
  Top 0.152: U$36.DO U$37.DI
N$37
  Top 0.152: U$37.DO U$38.DI
N$38
  Top 0.152: U$38.DO U$39.DI
N$39
  Top 0.152: U$39.DO U$40.DI
N$40
  Top 0.152: U$40.DO U$41.DI
N$41
  Top 0.152: U$41.DO U$42.DI
N$42
  Top 0.152: U$42.DO U$43.DI
N$43
  Top 0.152: U$43.DO U$44.DI
N$44
  Top 0.152: U$44.DO U$45.DI
N$45
  Top 0.152: U$45.DO U$46.DI
N$46
  Top 0.152: U$46.DO U$47.DI
N$47
  Top 0.152: U$47.DO U$48.DI
N$48
  Top 0.152: U$48.DO U$49.DI
N$49
  Top 0.152: U$49.DO U$50.DI
N$50
  Top 0.152: U$50.DO U$51.DI
N$51
  Top 0.152: U$51.DO U$52.DI
N$52
  Top 0.152: U$52.DO U$53.DI
N$53
  Top 0.152: U$53.DO U$54.DI
N$54
  Top 0.152: U$54.DO U$55.DI
N$55
  Top 0.152: U$55.DO U$56.DI
N$56
  Top 0.152: U$56.DO U$57.DI
N$57
  Top 0.152: U$57.DO U$58.DI
N$58
  Top 0.152: U$58.DO U$59.DI
N$59
  Top 0.152: U$59.DO U$60.DI
N$60
  Top 0.152: U$60.DO U$61.DI
N$61
  Top 0.152: U$61.DO U$62.DI
N$62
  Top 0.152: U$62.DO U$63.DI
N$63
  Top 0.152: U$63.DO U$64.DI
N$65
  Top 0.152: U$65.DO U$66.DI
N$66
  Top 0.152: U$66.DO U$67.DI
N$67
  Top 0.152: U$67.DO U$68.DI
N$68
  Top 0.152: U$68.DO U$69.DI
N$69
  Top 0.152: U$69.DO U$70.DI
N$70
  Top 0.152: U$70.DO U$71.DI
N$71
  Top 0.152: U$71.DO U$72.DI
N$72
  Top 0.152: U$72.DO U$73.DI
N$73
  Top 0.152: U$73.DO U$74.DI
N$74
  Top 0.152: U$74.DO U$75.DI
N$75
  Top 0.152: U$75.DO U$76.DI
N$76
  Top 0.152: U$76.DO U$77.DI
N$77
  Top 0.152: U$77.DO U$78.DI
N$78
  Top 0.152: U$78.DO U$79.DI
N$79
  Top 0.152: U$79.DO U$80.DI
N$80
  Top 0.152: U$80.DO U$81.DI
N$81
  Top 0.152: U$81.DO U$82.DI
N$82
  Top 0.152: U$82.DO U$83.DI
N$83
  Top 0.152: U$83.DO U$84.DI
N$84
  Top 0.152: U$84.DO U$85.DI
N$85
  Top 0.152: U$85.DO U$86.DI
N$86
  Top 0.152: U$86.DO U$87.DI
N$87
  Top 0.152: U$87.DO U$88.DI
N$88
  Top 0.152: U$88.DO U$89.DI
N$89
  Top 0.152: U$89.DO U$90.DI
N$90
  Top 0.152: U$90.DO U$91.DI
N$91
  Top 0.152: U$91.DO U$92.DI
N$92
  Top 0.152: U$92.DO U$93.DI
N$93
  Top 0.152: U$93.DO U$94.DI
N$94
  Top 0.152: U$94.DO U$95.DI
N$95
  Top 0.152: U$95.DO U$96.DI
N$96
  Top 0.152: U$96.DO U$97.DI
N$97
  Top 0.152: U$97.DO U$98.DI
N$98
  Top 0.152: U$98.DO U$99.DI
N$99
  Top 0.152: U$99.DO U$100.DI
N$100
  Top 0.152: U$100.DO U$101.DI
N$101
  Top 0.152: U$101.DO U$102.DI
N$102
  Top 0.152: U$102.DO U$103.DI
N$103
  Top 0.152: U$103.DO U$104.DI
N$104
  Top 0.152: U$104.DO U$105.DI
N$105
  Top 0.152: U$105.DO U$106.DI
N$106
  Top 0.152: U$106.DO U$107.DI
N$107
  Top 0.152: U$107.DO U$108.DI
N$108
  Top 0.152: U$108.DO U$109.DI
N$109
  Top 0.152: U$109.DO U$110.DI
N$110
  Top 0.152: U$110.DO U$111.DI
N$111
  Top 0.152: U$111.DO U$112.DI
N$112
  Top 0.152: U$112.DO U$113.DI
N$113
  Top 0.152: U$113.DO U$114.DI
N$114
  Top 0.152: U$114.DO U$115.DI
N$115
  Top 0.152: U$115.DO U$116.DI
N$116
  Top 0.152: U$116.DO U$117.DI
N$117
  Top 0.152: U$117.DO U$118.DI
N$118
  Top 0.152: U$118.DO U$119.DI
N$119
  Top 0.152: U$119.DO U$120.DI
N$120
  Top 0.152: U$120.DO U$121.DI
N$121
  Top 0.152: U$121.DO U$122.DI
N$122
  Top 0.152: U$122.DO U$123.DI
N$123
  Top 0.152: U$123.DO U$124.DI
N$124
  Top 0.152: U$124.DO U$125.DI
N$125
  Top 0.152: U$125.DO U$126.DI
N$126
  Top 0.152: U$126.DO U$127.DI
N$127
  Top 0.152: U$127.DO U$128.DI
(copper drawn outside any net)
  shapes: Bottom area x1